# Altium schematic sheet MR26_GSS_5.SchDoc
size 385 x 297 mm; Origin: Eagle; OriginPath: C:\Users\David Nguyen\Downloads\eagle\eagle\MR26_GSS.sch; OriginSheet: 6; OriginDescription: 07 FPGA I/O, camera FPC & IR illumination
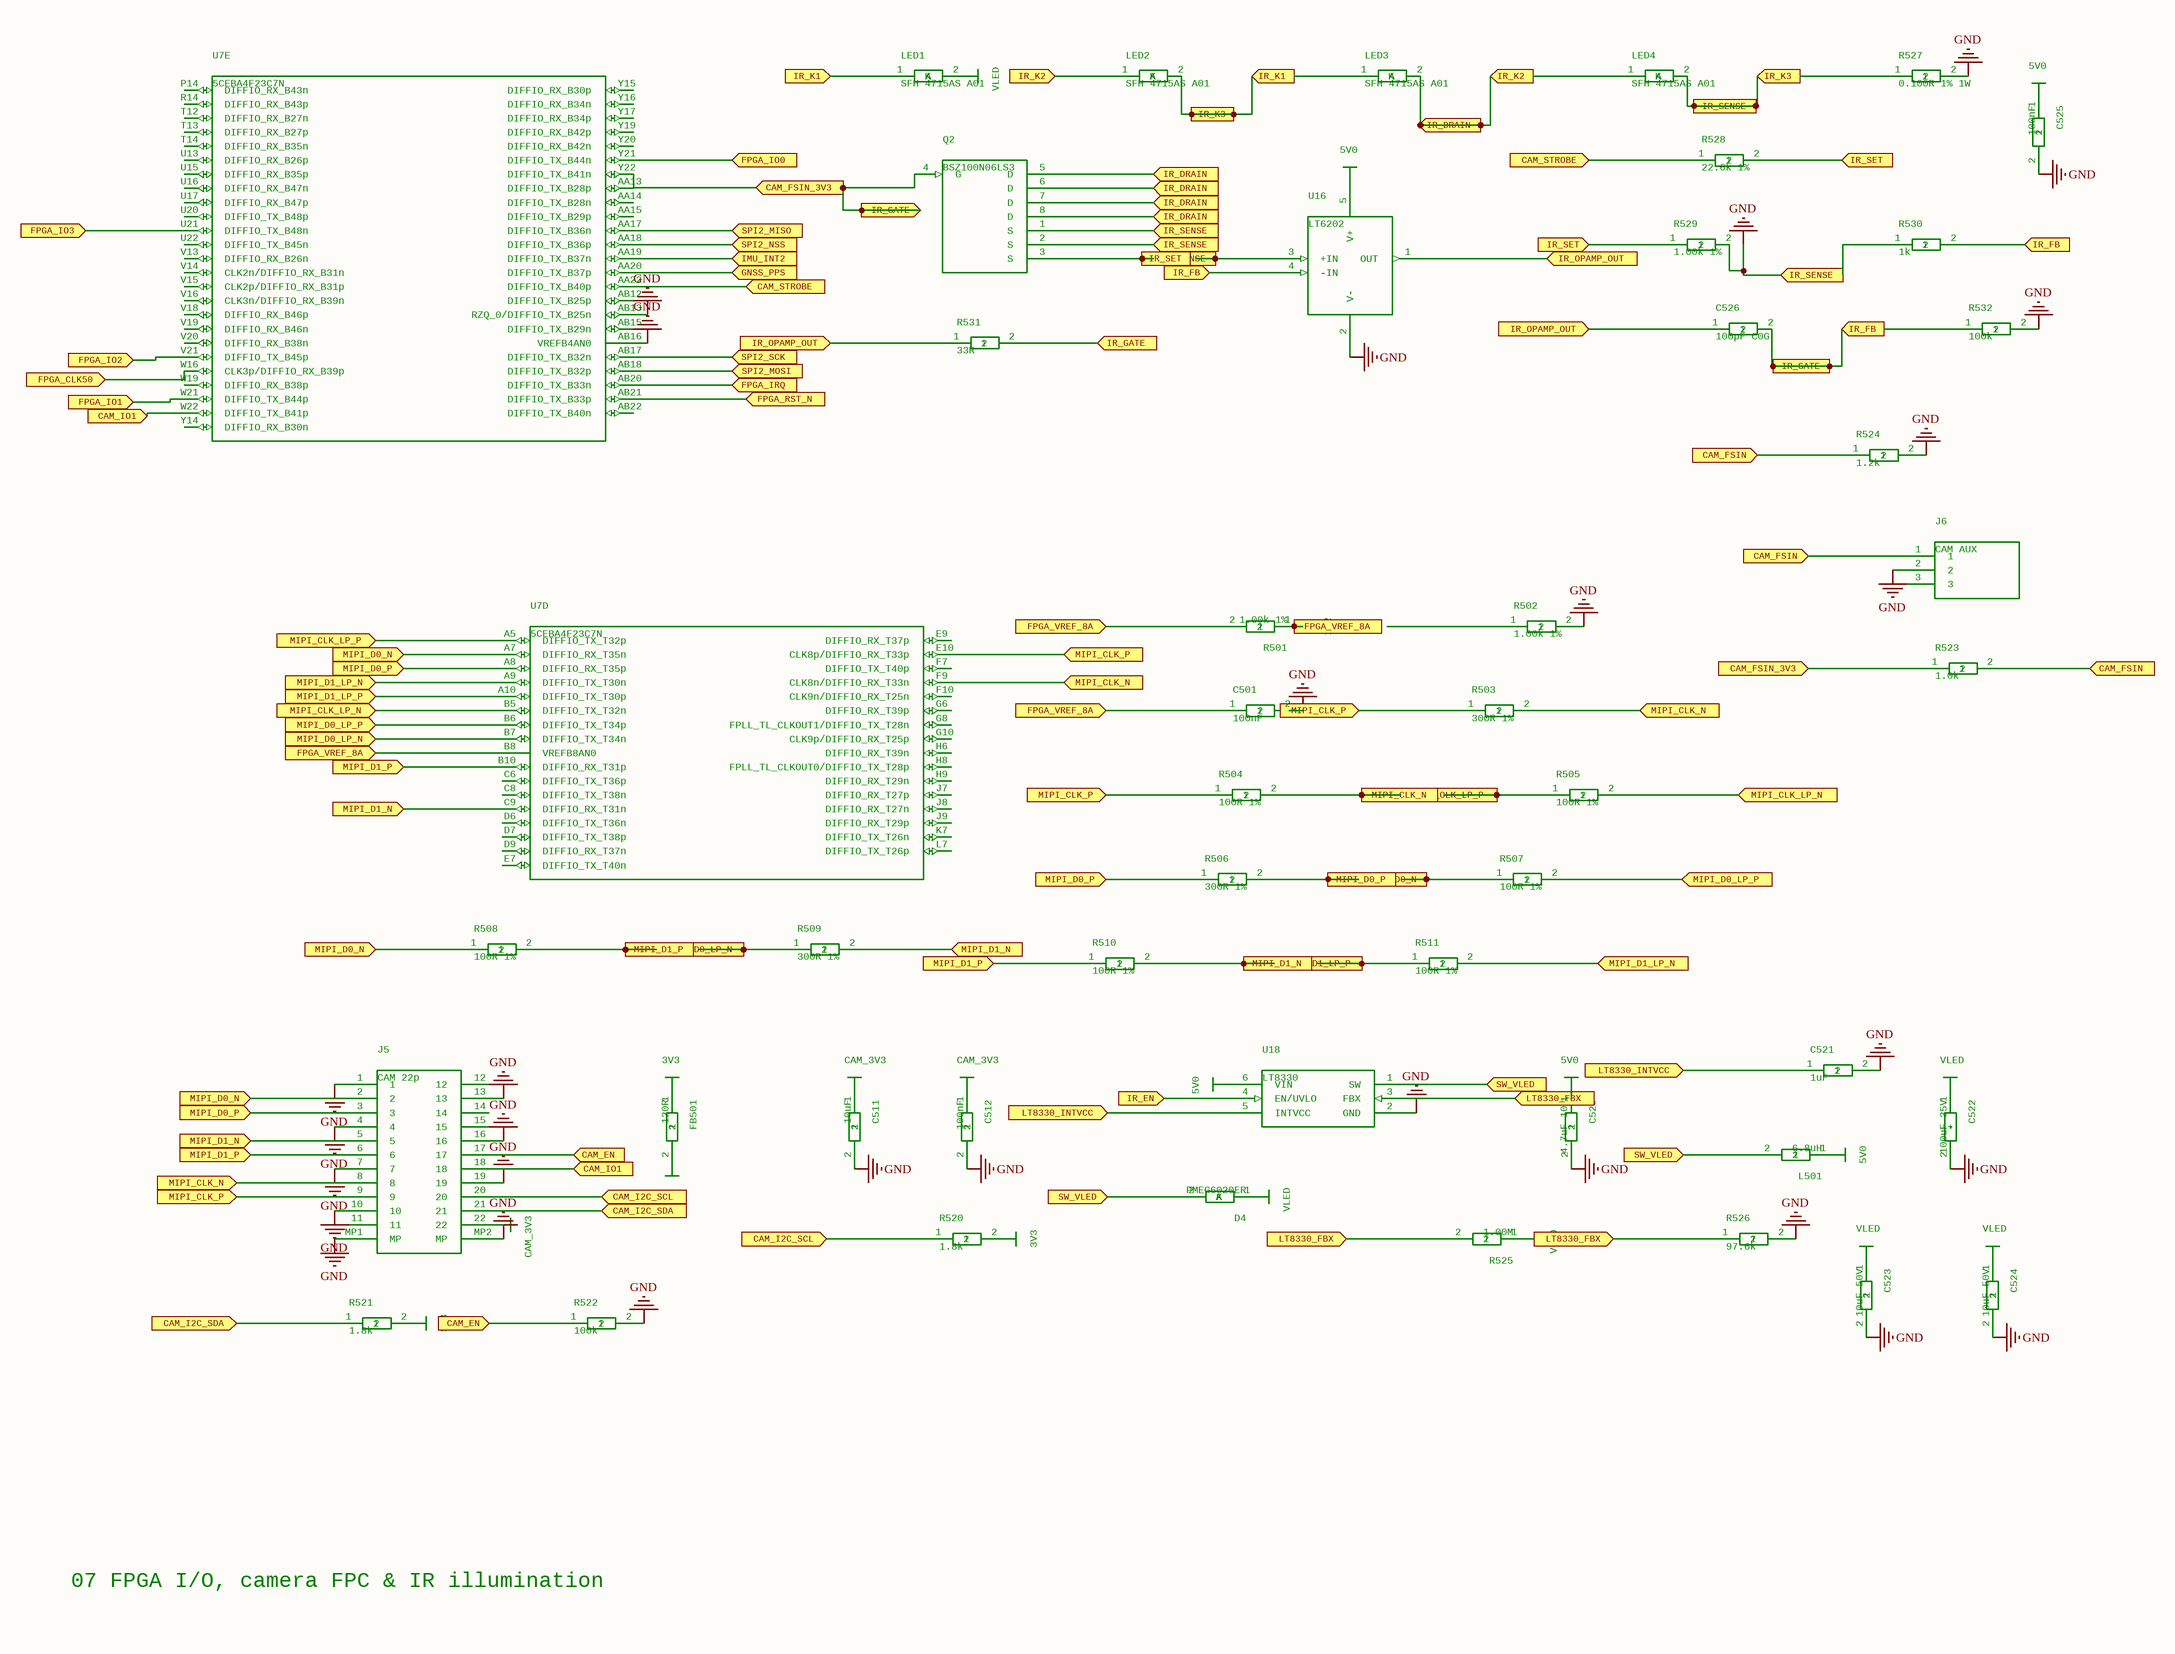
[diagram p0: MR26_GSS_5.SchDoc]

## Parts
C501  100nF  [C_0402]
C511  10uF  [C_0603]
C512  100nF  [C_0402]
C520  4.7uF 10V  [C_0603]
C521  1uF  [C_0402]
C522  100uF 35V  [C_CP_Elec_6.3x7.7]
C523  10uF 50V  [C_1210]
C524  10uF 50V  [C_1210]
C525  100nF  [C_0402]
C526  100pF C0G  [C_0402]
D4  PMEG6020ER  [D_SOD-123W]
FB501  120R  [L_0603]
J5  CAM 22p  [FH12-22S-0.5SH]
J6  CAM AUX  [PinHeader_1x03_P2.54mm]
L501  6.8uH  [L_XEL4030]
LED1  SFH 4715AS A01  [OSLON_Black_3.75x3.75]
LED2  SFH 4715AS A01  [OSLON_Black_3.75x3.75]
LED3  SFH 4715AS A01  [OSLON_Black_3.75x3.75]
LED4  SFH 4715AS A01  [OSLON_Black_3.75x3.75]
PWR0443  1V2
PWR0456  CAM_3V3
PWR0458  3V3
PWR0459  CAM_3V3
PWR0460  CAM_3V3
PWR0462  CAM_3V3
PWR0464  3V3
PWR0465  3V3
PWR0469  5V0
PWR0471  5V0
PWR0474  5V0
PWR0475  VLED
PWR0476  VLED
PWR0478  VLED
PWR0480  VLED
PWR0482  VLED
PWR0484  VLED
PWR0486  5V0
PWR0488  5V0
Q2  BSZ100N06LS3  [PG-TSDSON-8]
R501  1.00k 1%  [R_0402]
R502  1.00k 1%  [R_0402]
R503  300R 1%  [R_0402]
R504  100R 1%  [R_0402]
R505  100R 1%  [R_0402]
R506  300R 1%  [R_0402]
R507  100R 1%  [R_0402]
R508  100R 1%  [R_0402]
R509  300R 1%  [R_0402]
R510  100R 1%  [R_0402]
R511  100R 1%  [R_0402]
R520  1.8k  [R_0402]
R521  1.8k  [R_0402]
R522  100k  [R_0402]
R523  1.0k  [R_0402]
R524  1.2k  [R_0402]
R525  1.00M  [R_0402]
R526  97.6k  [R_0402]
R527  0.100R 1% 1W  [R_1206]
R528  22.6k 1%  [R_0402]
R529  1.00k 1%  [R_0402]
R530  1k  [R_0402]
R531  33R  [R_0402]
R532  100k  [R_0402]
U7  5CEBA4F23C7N  [FBGA-484_23x23_1.0mm]  (parts D,E of 12)
U16  LT6202  [TSOT-23-5]
U18  LT8330  [TSOT-23-6]

## Ports
CAM_EN (in), CAM_FSIN (in), CAM_FSIN_3V3 (in), CAM_I2C_SCL (in), CAM_I2C_SDA (in), CAM_IO1 (in), CAM_STROBE (in), FPGA_CLK50 (in), FPGA_IO0 (in), FPGA_IO1 (in), FPGA_IO2 (in), FPGA_IO3 (in), FPGA_IRQ (in), FPGA_RST_N (in), FPGA_VREF_8A (in), GNSS_PPS (in), IMU_INT2 (in), IR_DRAIN (in), IR_EN (in), IR_FB (in), IR_GATE (in), IR_K1 (in), IR_K2 (in), IR_K3 (in), IR_OPAMP_OUT (in), IR_SENSE (in), IR_SET (in), LT8330_FBX (in), LT8330_INTVCC (in), MIPI_CLK_LP_N (in), MIPI_CLK_LP_P (in), MIPI_CLK_N (in), MIPI_CLK_P (in), MIPI_D0_LP_N (in), MIPI_D0_LP_P (in), MIPI_D0_N (in), MIPI_D0_P (in), MIPI_D1_LP_N (in), MIPI_D1_LP_P (in), MIPI_D1_N (in), MIPI_D1_P (in), SPI2_MISO (in), SPI2_MOSI (in), SPI2_NSS (in), SPI2_SCK (in), SW_VLED (in)

## Nets
GND: C501.2 C511.2 C512.2 C520.2 C521.2 C522.2(-) C523.2 C524.2 C525.2 J5.1 J5.4 J5.7 J5.10 J5.13 J5.16 J5.19 J5.MP1(MP) J5.MP2(MP) J6.2 LED1.1(K) LED2.2(A) LED3.1(K) LED4.2(A) Q2.1(S) Q2.2(S) Q2.3(S) R502.2 R522.2 R524.2 R526.2 R527.1 R527.2 R528.2 R529.1 R529.2 R530.1 R532.2 U7.AB13(RZQ_0/DIFFIO_TX_B25n) U7.AB16(VREFB4AN0) U16.2(V-) U16.3(+IN) U18.2(GND) ; port IR_K1, port IR_K3, port IR_SENSE, port IR_SET
CAM_EN: J5.17 R522.1 ; port CAM_EN
CAM_FSIN: J6.1 R523.2 R524.1 ; port CAM_FSIN
CAM_FSIN_3V3: C526.2 Q2.4(G) R523.1 R530.2 R531.2 R532.1 U7.Y22(DIFFIO_TX_B41n) U16.4(-IN) ; port CAM_FSIN_3V3, port IR_GATE, port IR_FB
CAM_I2C_SCL: J5.20 R520.1 ; port CAM_I2C_SCL
CAM_I2C_SDA: J5.21 R521.1 ; port CAM_I2C_SDA
CAM_IO1: J5.18 U7.W22(DIFFIO_TX_B41p) ; port CAM_IO1
CAM_STROBE: R528.1 U7.AA22(DIFFIO_TX_B40p) ; port CAM_STROBE
FPGA_CLK50: U7.W16(CLK3p/DIFFIO_RX_B39p) ; port FPGA_CLK50
FPGA_IO0: U7.Y21(DIFFIO_TX_B44n) ; port FPGA_IO0
FPGA_IO1: U7.W21(DIFFIO_TX_B44p) ; port FPGA_IO1
FPGA_IO2: U7.V21(DIFFIO_TX_B45p) ; port FPGA_IO2
FPGA_IO3: U7.U21(DIFFIO_TX_B48n) ; port FPGA_IO3
FPGA_IRQ: U7.AB20(DIFFIO_TX_B33n) ; port FPGA_IRQ
FPGA_RST_N: U7.AB21(DIFFIO_TX_B33p) ; port FPGA_RST_N
FPGA_VREF_8A: C501.1 PWR0443.?1(1V2) R501.1 R501.2 U7.B8(VREFB8AN0) ; port FPGA_VREF_8A
GNSS_PPS: U7.AA20(DIFFIO_TX_B37p) ; port GNSS_PPS
IMU_INT2: U7.AA19(DIFFIO_TX_B37n) ; port IMU_INT2
IR_DRAIN: LED2.1(K) LED3.2(A) LED4.1(K) Q2.5(D) Q2.6(D) Q2.7(D) Q2.8(D) ; port IR_K2, port IR_DRAIN
IR_EN: U18.4(EN/UVLO) ; port IR_EN
IR_OPAMP_OUT: C526.1 R531.1 U16.1(OUT) ; port IR_OPAMP_OUT
LT8330_FBX: R525.2 R526.1 U18.3(FBX) ; port LT8330_FBX
LT8330_INTVCC: C521.1 U18.5(INTVCC) ; port LT8330_INTVCC
MIPI_CLK_LP_N: R505.2 U7.B5(DIFFIO_TX_T32n) ; port MIPI_CLK_LP_N
MIPI_CLK_LP_P: J5.8 R503.2 R504.2 R505.1 U7.A5(DIFFIO_TX_T32p) U7.F9(CLK8n/DIFFIO_RX_T33n) ; port MIPI_CLK_LP_P, port MIPI_CLK_N
MIPI_CLK_P: J5.9 R503.1 R504.1 U7.E10(CLK8p/DIFFIO_RX_T33p) ; port MIPI_CLK_P
MIPI_D0_LP_N: J5.6 R508.2 R509.1 R510.1 U7.B7(DIFFIO_TX_T34n) U7.B10(DIFFIO_RX_T31p) ; port MIPI_D0_LP_N, port MIPI_D1_P
MIPI_D0_LP_P: R507.2 U7.B6(DIFFIO_TX_T34p) ; port MIPI_D0_LP_P
MIPI_D0_N: J5.2 J5.3 R506.1 R506.2 R507.1 R508.1 U7.A7(DIFFIO_RX_T35n) U7.A8(DIFFIO_RX_T35p) ; port MIPI_D0_N, port MIPI_D0_P
MIPI_D1_LP_N: R511.2 U7.A9(DIFFIO_TX_T30n) ; port MIPI_D1_LP_N
MIPI_D1_LP_P: J5.5 R509.2 R510.2 R511.1 U7.A10(DIFFIO_TX_T30p) U7.C9(DIFFIO_RX_T31n) ; port MIPI_D1_LP_P, port MIPI_D1_N
SPI2_MISO: U7.AA17(DIFFIO_TX_B36n) ; port SPI2_MISO
SPI2_MOSI: U7.AB18(DIFFIO_TX_B32p) ; port SPI2_MOSI
SPI2_NSS: U7.AA18(DIFFIO_TX_B36p) ; port SPI2_NSS
SPI2_SCK: U7.AB17(DIFFIO_TX_B32n) ; port SPI2_SCK
SW_VLED: D4.2(A) L501.2 U18.1(SW) ; port SW_VLED
NetC511_1: C511.1 PWR0460.?1(CAM_3V3)
NetC512_1: C512.1 PWR0462.?1(CAM_3V3)
NetC520_1: C520.1 PWR0471.?1(5V0)
NetC522_1: C522.1(+) PWR0478.?1(VLED)
NetC523_1: C523.1 PWR0480.?1(VLED)
NetC524_1: C524.1 PWR0482.?1(VLED)
NetC525_1: C525.1 PWR0488.?1(5V0)
NetD4_1: D4.1(K) PWR0475.?1(VLED)
NetFB501_1: FB501.1 PWR0458.?1(3V3)
NetFB501_2: FB501.2 PWR0459.?1(CAM_3V3)
NetJ5_22: J5.22 PWR0456.?1(CAM_3V3)
NetL501_1: L501.1 PWR0474.?1(5V0)
NetLED1_2: LED1.2(A) PWR0484.?1(VLED)
NetPWR0464_?1: PWR0464.?1(3V3) R520.2
NetPWR0465_?1: PWR0465.?1(3V3) R521.2
NetPWR0469_?1: PWR0469.?1(5V0) U18.6(VIN)
NetPWR0476_?1: PWR0476.?1(VLED) R525.1
NetPWR0486_?1: PWR0486.?1(5V0) U16.5(V+)

Not connected (* = marked no-connect by the designer): J5 11 12 14 15; J6 3; R502 1; U7 AA13(DIFFIO_TX_B28p) AA14(DIFFIO_TX_B28n) AA15(DIFFIO_TX_B29p) AB12(DIFFIO_TX_B25p) AB15(DIFFIO_TX_B29n) AB22(DIFFIO_TX_B40n) C6(DIFFIO_TX_T36p) C8(DIFFIO_TX_T38n) D6(DIFFIO_TX_T36n) D7(DIFFIO_TX_T38p) D9(DIFFIO_RX_T37n) E7(DIFFIO_TX_T40n) E9(DIFFIO_RX_T37p) F7(DIFFIO_TX_T40p) F10(CLK9n/DIFFIO_RX_T25n) G6(DIFFIO_RX_T39p) G8(FPLL_TL_CLKOUT1/DIFFIO_TX_T28n) G10(CLK9p/DIFFIO_RX_T25p) H6(DIFFIO_RX_T39n) H8(FPLL_TL_CLKOUT0/DIFFIO_TX_T28p) H9(DIFFIO_RX_T29n) J7(DIFFIO_RX_T27p) J8(DIFFIO_RX_T27n) J9(DIFFIO_RX_T29p) K7(DIFFIO_TX_T26n) L7(DIFFIO_TX_T26p) P14(DIFFIO_RX_B43n) R14(DIFFIO_RX_B43p) T12(DIFFIO_RX_B27n) T13(DIFFIO_RX_B27p) T14(DIFFIO_RX_B35n) U13(DIFFIO_RX_B26p) U15(DIFFIO_RX_B35p) U16(DIFFIO_RX_B47n) U17(DIFFIO_RX_B47p) U20(DIFFIO_TX_B48p) U22(DIFFIO_TX_B45n) V13(DIFFIO_RX_B26n) V14(CLK2n/DIFFIO_RX_B31n) V15(CLK2p/DIFFIO_RX_B31p) V16(CLK3n/DIFFIO_RX_B39n) V18(DIFFIO_RX_B46p) V19(DIFFIO_RX_B46n) V20(DIFFIO_RX_B38n) W19(DIFFIO_RX_B38p) Y14(DIFFIO_RX_B30n) Y15(DIFFIO_RX_B30p) Y16(DIFFIO_RX_B34n) Y17(DIFFIO_RX_B34p) Y19(DIFFIO_RX_B42p) Y20(DIFFIO_RX_B42n)

## Notes on the sheet
- 07 FPGA I/O, camera FPC & IR illumination

## Library data of the parts
C501 C512 C525 = CAPC_0402: MPN: CAP 100nF 0402; GateName_1: G$1; SymbolName_1: CAP; DeviceName: C_0402; LibraryName: MR26; DeviceSetName: CAP
C511 = CAPC_0603: MPN: CAP 10uF 0603; GateName_1: G$1; SymbolName_1: CAP; DeviceName: C_0603; LibraryName: MR26; DeviceSetName: CAP
C520 = CAPC_0603: MPN: CAP 4.7uF 10V 0603; GateName_1: G$1; SymbolName_1: CAP; DeviceName: C_0603; LibraryName: MR26; DeviceSetName: CAP
C521 = CAPC_0402: MPN: CAP 1uF 0402; GateName_1: G$1; SymbolName_1: CAP; DeviceName: C_0402; LibraryName: MR26; DeviceSetName: CAP
C522 = CAP_POLC_CP_Elec_6.3x7.7: MPN: Panasonic EEH-ZA1V101P; GateName_1: G$1; SymbolName_1: CAP_POL; DeviceName: C_CP_Elec_6.3x7.7; LibraryName: MR26; DeviceSetName: CAP_POL
C523 C524 = CAPC_1210: MPN: CAP 10uF 50V 1210; GateName_1: G$1; SymbolName_1: CAP; DeviceName: C_1210; LibraryName: MR26; DeviceSetName: CAP
C526 = CAPC_0402: MPN: CAP 100pF C0G 0402; GateName_1: G$1; SymbolName_1: CAP; DeviceName: C_0402; LibraryName: MR26; DeviceSetName: CAP
D4 = DIODE_SCHOTTKYD_SOD-123W: GateName_1: G$1; SymbolName_1: DIODE_SCHOTTKY; DeviceName: D_SOD-123W; LibraryName: MR26; DeviceSetName: DIODE_SCHOTTKY; MPN: PMEG6020ER
FB501 = FERRITEL_0603: MPN: Murata BLM18PG121SN1D; GateName_1: G$1; SymbolName_1: FERRITE; DeviceName: L_0603; LibraryName: MR26; DeviceSetName: FERRITE
J5 = FH12_22SFH12-22S-0.5SH: MPN: Hirose FH12-22S-0.5SH(55); GateName_1: G$1; SymbolName_1: FH12_22S; DeviceName: FH12-22S-0.5SH; LibraryName: MR26; DeviceSetName: FH12_22S
J6 = HDR_1X3PinHeader_1x03_P2.54mm: MPN: Wurth 61300311121; GateName_1: G$1; SymbolName_1: HDR_1X3; DeviceName: PinHeader_1x03_P2.54mm; LibraryName: MR26; DeviceSetName: HDR_1X3
L501 = INDL_XEL4030: MPN: Coilcraft XEL4030-682MEC; GateName_1: G$1; SymbolName_1: IND; DeviceName: L_XEL4030; LibraryName: MR26; DeviceSetName: IND
LED1-LED4 = LEDOSLON_Black_3.75x3.75: MPN: ams OSRAM SFH 4715AS A01 (Q65112A3325); GateName_1: G$1; SymbolName_1: LED; DeviceName: OSLON_Black_3.75x3.75; LibraryName: MR26; DeviceSetName: LED
PWR0443 = PWR_1V2: GateName_1: G$1; SymbolName_1: PWR_1V2; LibraryName: MR26; DeviceSetName: PWR_1V2
PWR0456 PWR0459 PWR0460 PWR0462 = PWR_CAM_3V3: GateName_1: G$1; SymbolName_1: PWR_CAM_3V3; LibraryName: MR26; DeviceSetName: PWR_CAM_3V3
PWR0458 PWR0464 PWR0465 = PWR_3V3: GateName_1: G$1; SymbolName_1: PWR_3V3; LibraryName: MR26; DeviceSetName: PWR_3V3
PWR0469 PWR0471 PWR0474 PWR0486 PWR0488 = PWR_5V0: GateName_1: G$1; SymbolName_1: PWR_5V0; LibraryName: MR26; DeviceSetName: PWR_5V0
PWR0475 PWR0476 PWR0478 PWR0480 PWR0482 PWR0484 = PWR_VLED: GateName_1: G$1; SymbolName_1: PWR_VLED; LibraryName: MR26; DeviceSetName: PWR_VLED
Q2 = NMOS_SUPERSO8PG-TSDSON-8: MPN: BSZ100N06LS3 G; GateName_1: G$1; SymbolName_1: NMOS_SUPERSO8; DeviceName: PG-TSDSON-8; LibraryName: MR26; DeviceSetName: NMOS_SUPERSO8
R501 R502 R529 = RESR_0402: MPN: RES 1.00k 1% 0402; GateName_1: G$1; SymbolName_1: RES; DeviceName: R_0402; LibraryName: MR26; DeviceSetName: RES
R503 R506 R509 = RESR_0402: MPN: RES 300R 1% 0402; GateName_1: G$1; SymbolName_1: RES; DeviceName: R_0402; LibraryName: MR26; DeviceSetName: RES
R504 R505 R507 R508 R510 R511 = RESR_0402: MPN: RES 100R 1% 0402; GateName_1: G$1; SymbolName_1: RES; DeviceName: R_0402; LibraryName: MR26; DeviceSetName: RES
R520 R521 = RESR_0402: MPN: RES 1.8k 0402; GateName_1: G$1; SymbolName_1: RES; DeviceName: R_0402; LibraryName: MR26; DeviceSetName: RES
R522 R532 = RESR_0402: MPN: RES 100k 0402; GateName_1: G$1; SymbolName_1: RES; DeviceName: R_0402; LibraryName: MR26; DeviceSetName: RES
R523 = RESR_0402: MPN: RES 1.0k 0402; GateName_1: G$1; SymbolName_1: RES; DeviceName: R_0402; LibraryName: MR26; DeviceSetName: RES
R524 = RESR_0402: MPN: RES 1.2k 0402; GateName_1: G$1; SymbolName_1: RES; DeviceName: R_0402; LibraryName: MR26; DeviceSetName: RES
R525 = RESR_0402: MPN: RES 1.00M 0402; GateName_1: G$1; SymbolName_1: RES; DeviceName: R_0402; LibraryName: MR26; DeviceSetName: RES
R526 = RESR_0402: MPN: RES 97.6k 0402; GateName_1: G$1; SymbolName_1: RES; DeviceName: R_0402; LibraryName: MR26; DeviceSetName: RES
R527 = RESR_1206: MPN: RES 0.100R 1% 1W 1206; GateName_1: G$1; SymbolName_1: RES; DeviceName: R_1206; LibraryName: MR26; DeviceSetName: RES
R528 = RESR_0402: MPN: RES 22.6k 1% 0402; GateName_1: G$1; SymbolName_1: RES; DeviceName: R_0402; LibraryName: MR26; DeviceSetName: RES
R530 = RESR_0402: MPN: RES 1k 0402; GateName_1: G$1; SymbolName_1: RES; DeviceName: R_0402; LibraryName: MR26; DeviceSetName: RES
R531 = RESR_0402: MPN: RES 33R 0402; GateName_1: G$1; SymbolName_1: RES; DeviceName: R_0402; LibraryName: MR26; DeviceSetName: RES
U7 = 5CEBA4F23C7NFBGA-484_23x23_1.0mm: GateName_1: A; SymbolName_1: 5CEBA4F23C7N_A; GateName_2: B; SymbolName_2: 5CEBA4F23C7N_B; GateName_3: C; SymbolName_3: 5CEBA4F23C7N_C; GateName_4: D; SymbolName_4: 5CEBA4F23C7N_D; GateName_5: E; SymbolName_5: 5CEBA4F23C7N_E; GateName_6: F; SymbolName_6: 5CEBA4F23C7N_F; GateName_7: G; SymbolName_7: 5CEBA4F23C7N_G; GateName_8: H; SymbolName_8: 5CEBA4F23C7N_H; GateName_9: I; SymbolName_9: 5CEBA4F23C7N_I; GateName_10: J; SymbolName_10: 5CEBA4F23C7N_J; GateName_11: K; SymbolName_11: 5CEBA4F23C7N_K; GateName_12: L; SymbolName_12: 5CEBA4F23C7N_L; DeviceName: FBGA-484_23x23_1.0mm; LibraryName: MR26; DeviceSetName: 5CEBA4F23C7N; MPN: 5CEBA4F23C7N
U16 = LT6202_TSOT5TSOT-23-5: MPN: LT6202HS5#TRPBF; GateName_1: G$1; SymbolName_1: LT6202_TSOT5; DeviceName: TSOT-23-5; LibraryName: MR26; DeviceSetName: LT6202_TSOT5
U18 = LT8330_TSOT6TSOT-23-6: MPN: LT8330ES6#TRMPBF; GateName_1: G$1; SymbolName_1: LT8330_TSOT6; DeviceName: TSOT-23-6; LibraryName: MR26; DeviceSetName: LT8330_TSOT6